# EAGLE design smoke_co_interface (EAGLE 9.6.2)
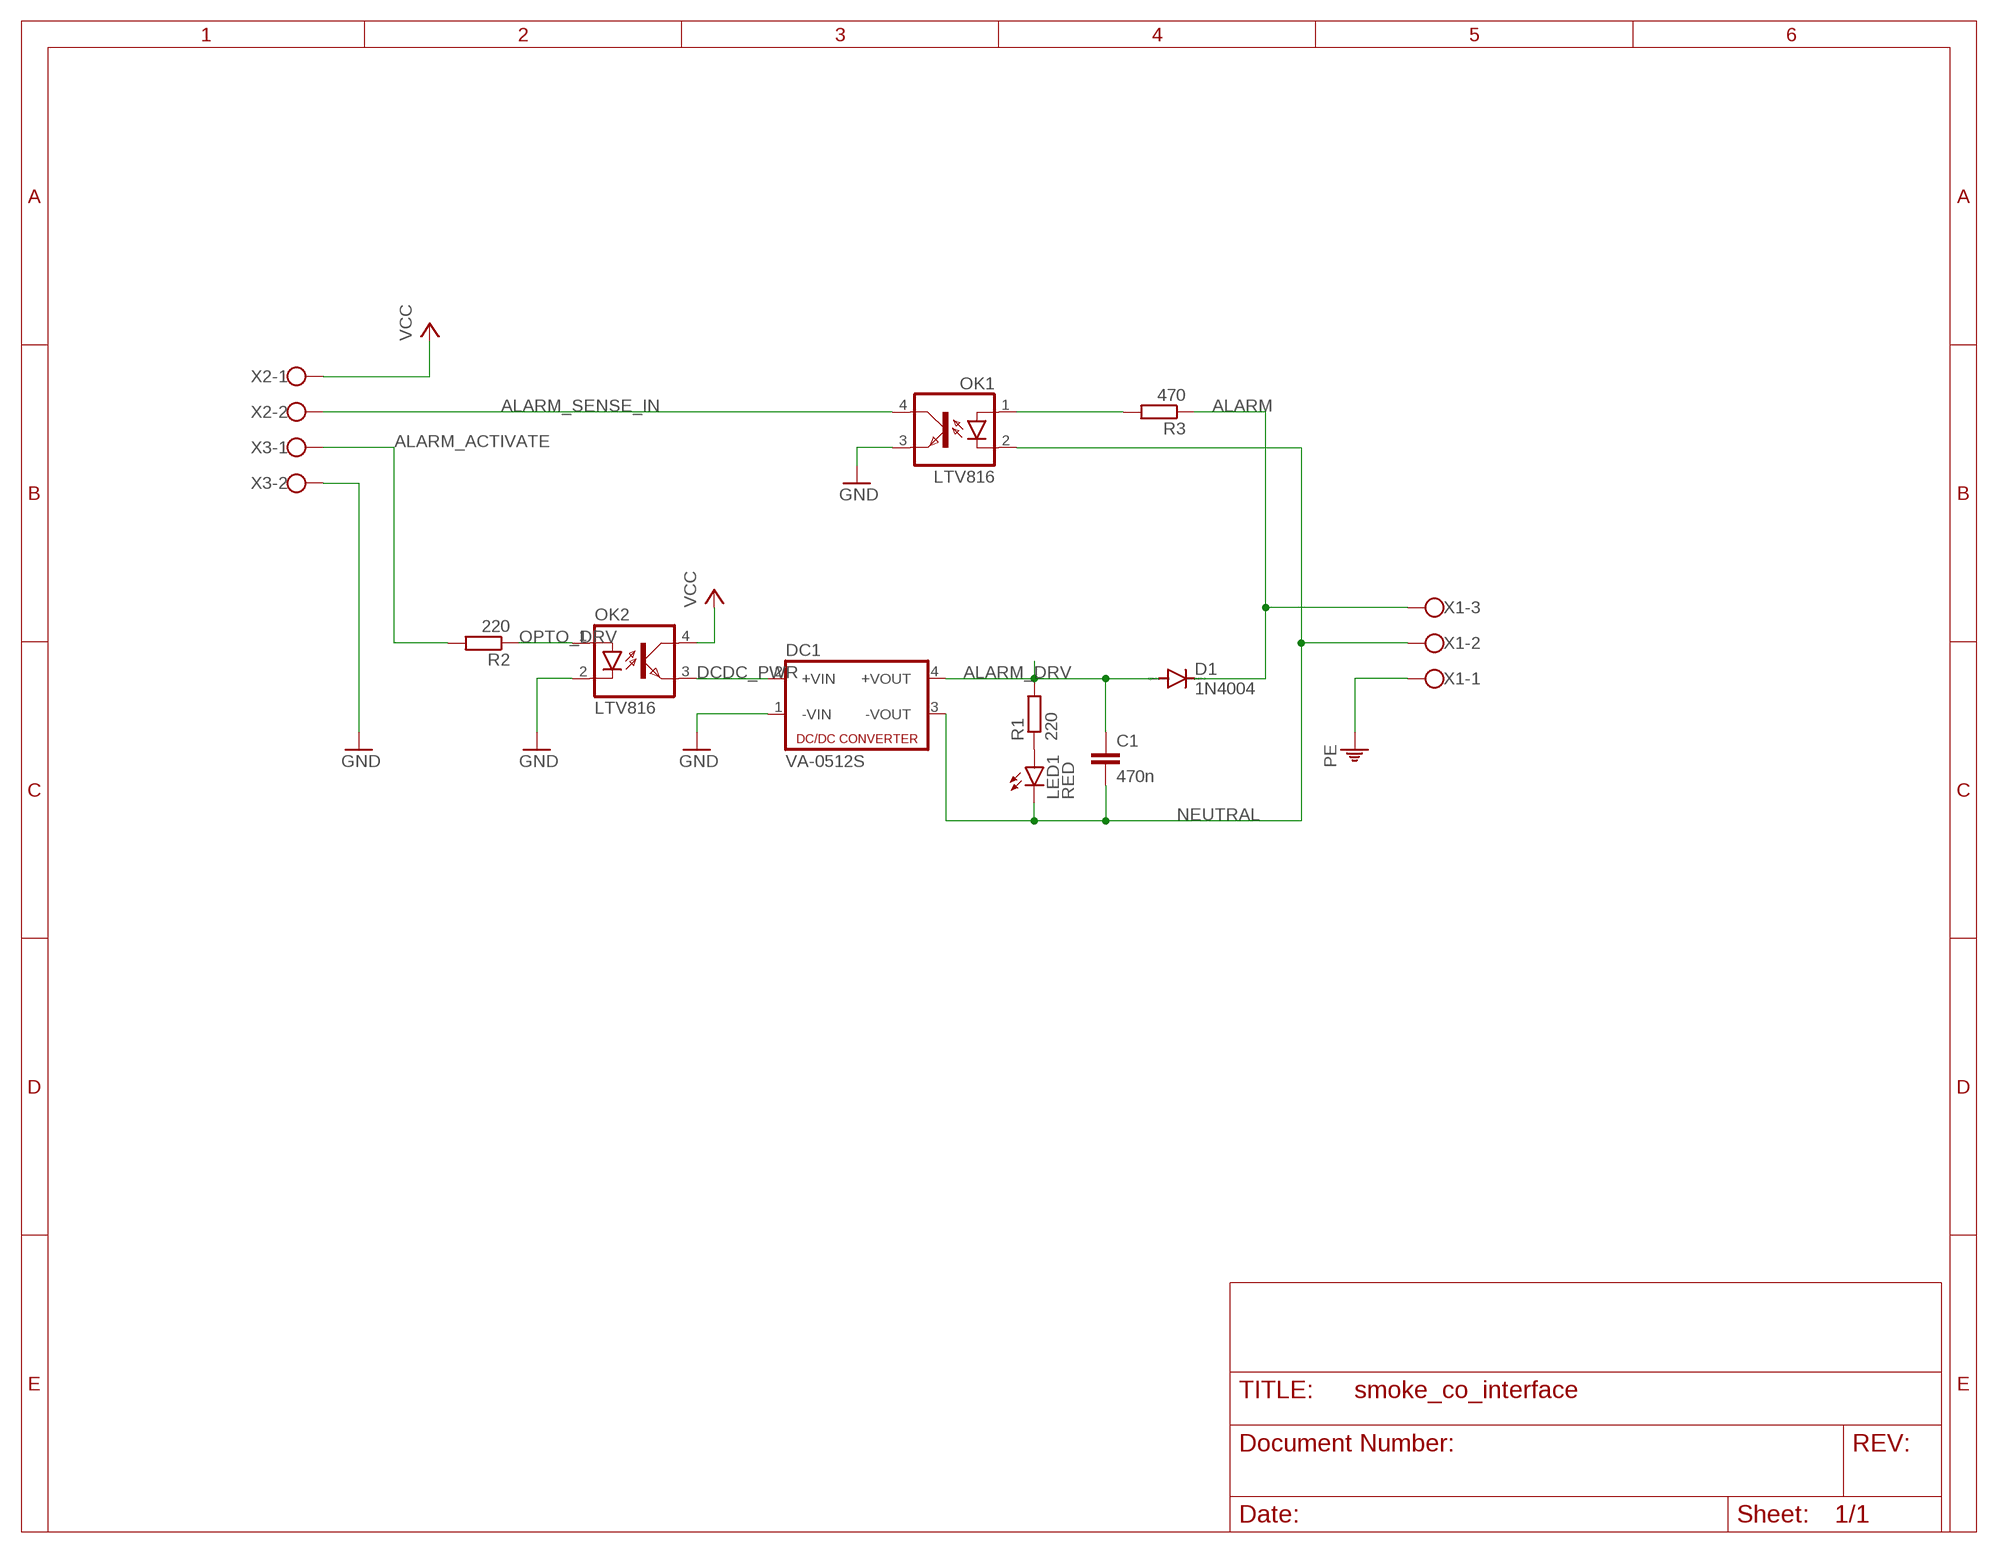
[diagram p0: schematic, sheet 1]

## Parts
C1  470n  C-EU050-035X075  [C050-035X075]
D1  1N4004  [DO41-10]
DC1  VA-0512S  [4SIL]
LED1  RED  LED3MM  [LED3MM]
OK1  LTV816  [DIL04]
OK2  LTV816  [DIL04]
R1  220  R-EU_0207/10  [0207/10]
R2  220  R-EU_0207/10  [0207/10]
R3  470  R-EU_0207/10  [0207/10]
X1  W237-103  [W237-103]
X2  W237-102  [W237-102]
X3  W237-102  [W237-102]

## Nets
ALARM [signal_hv]: D1.C R3.1 X1.3
ALARM_ACTIVATE: R2.2 X3.1
ALARM_DRV [signal_hv]: C1.1 D1.A DC1.4(+VOUT) R1.2
ALARM_SENSE [signal_hv]: OK1.1(A) R3.2
ALARM_SENSE_IN: OK1.4(COL) X2.2
DCDC_PWR: DC1.2(+VIN) OK2.3(EMIT)
GND [supply]: DC1.1(-VIN) OK1.3(EMIT) OK2.2(C) X3.2
N$1 [signal_hv]: LED1.A R1.1
NEUTRAL [supply_hv]: C1.2 DC1.3(-VOUT) LED1.K(C) OK1.2(C) X1.2
OPTO_DRV: OK2.1(A) R2.1
PE [supply_hv]: X1.1
VCC [supply]: OK2.4(COL) X2.1

## Library data of the parts
C1 = rcl:C-EU: CAPACITOR, European symbol; SPICEPREFIX: C
D1 = diode:1N4004: DIODE general purpose rectifier, 1 A
DC1 = dc-dc-converter:VA-*?: DC DC Converter Single Output, 1 Watt Motien Technology Co.,Ltd. Source: Data sheet <http://www.motien.com.tw/data_sheet/VA-1%28H%29.pdf>; OC_FARNELL: unknown; OC_NEWARK: unknown
LED1 = led:LED: LED OSRAM: - CHIPLED LG R971, LG N971, LY N971, LG Q971, LY Q971, LO R971, LY R971 LH N974, LH R974 LS Q976, LO Q976, LY Q976 LO Q996 - Hyper CHIPLED LW Q18S LB Q993, LB Q99A, LB R99A - SideLED LS A670, LO A670, LY A670, LG A670, LP A670 LB A673, LV A673, LT A673, LW A673 LH A674 LY A675 LS A676, LA A676, LO A676, LY A676, LW A676 LS A679, LY A679, LG A679 - Hyper Micro SIDELED® LS Y876, LA Y876, LO Y876, LY Y876 LT Y87S - SmartLED LW L88C, LW L88S LB L89C, LB L89S, LG L890 LS L89K, LO L89K, LY L89K LS L896, LA L896, LO L896, LY L896 - TOPLED LS T670, LO T670, LY T670, LG T670, LP T670 LSG T670, LSP T670, LSY T670, LOP T670, LYG T670 LG T671, LOG T671, LSG T671 LB T673, LV T673, LT T673, LW T673 LH T674 LS T676, LA T676, LO T676, LY T676, LB T676, LH T676, LSB T676, LW T676 LB T67C, LV T67C, LT T67C, LS T67K, LO T67K, LY T67K, LW E67C LS E67B, LA E67B, LO E67B, LY E67B, LB E67C, LV E67C, LT E67C LW T67C LS T679, LY T679, LG T679 LS T770, LO T770, LY T770, LG T770, LP T770 LB T773, LV T773, LT T773, LW T773 LH T774 LS E675, LA E675, LY E675, LS T675 LS T776, LA T776, LO T776, LY T776, LB T776 LHGB T686 LT T68C, LB T68C - Hyper Mini TOPLED® LB M676 - Mini TOPLED Santana® LG M470 LS M47K, LO M47K, LY M47K Source: http://www.osram.convergy.de LUXEON: - LUMILED® LXK2-PW12-R00, LXK2-PW12-S00, LXK2-PW14-U00, LXK2-PW14-V00 LXK2-PM12-R00, LXK2-PM12-S00, LXK2-PM14-U00 LXK2-PE12-Q00, LXK2-PE12-R00, LXK2-PE12-S00, LXK2-PE14-T00, LXK2-PE14-U00 LXK2-PB12-K00, LXK2-PB12-L00, LXK2-PB12-M00, LXK2-PB14-N00, LXK2-PB14-P00, LXK2-PB14-Q00 LXK2-PR12-L00, LXK2-PR12-M00, LXK2-PR14-Q00, LXK2-PR14-R00 LXK2-PD12-Q00, LXK2-PD12-R00, LXK2-PD12-S00 LXK2-PH12-R00, LXK2-PH12-S00 LXK2-PL12-P00, LXK2-PL12-Q00, LXK2-PL12-R00 Source: www.luxeon.com KINGBRIGHT: KA-3528ASYC Source: www.kingbright.com
OK1 OK2 = optocoupler:LTV816: OPTO COUPLER Source: LITEON, LTV816.pdf; OC_FARNELL: unknown; OC_NEWARK: unknown
R1-R3 = rcl:R-EU_: RESISTOR, European symbol; SPICEPREFIX: R
X1 = con-wago-500:W237-103: WAGO SCREW CLAMP; MPN: 237-103; OC_FARNELL: unknown; OC_NEWARK: 18M7116
X2 X3 = con-wago-500:W237-102: WAGO SCREW CLAMP; MPN: 237-102; OC_FARNELL: unknown; OC_NEWARK: 70K9898

## Net classes
0 default: width 0.813 mm
1 supply: width 1.626 mm
2 signal_hv: width 0.813 mm, clearance 0.61 mm
3 supply_hv: width 1.626 mm, clearance 0.61 mm

## Board
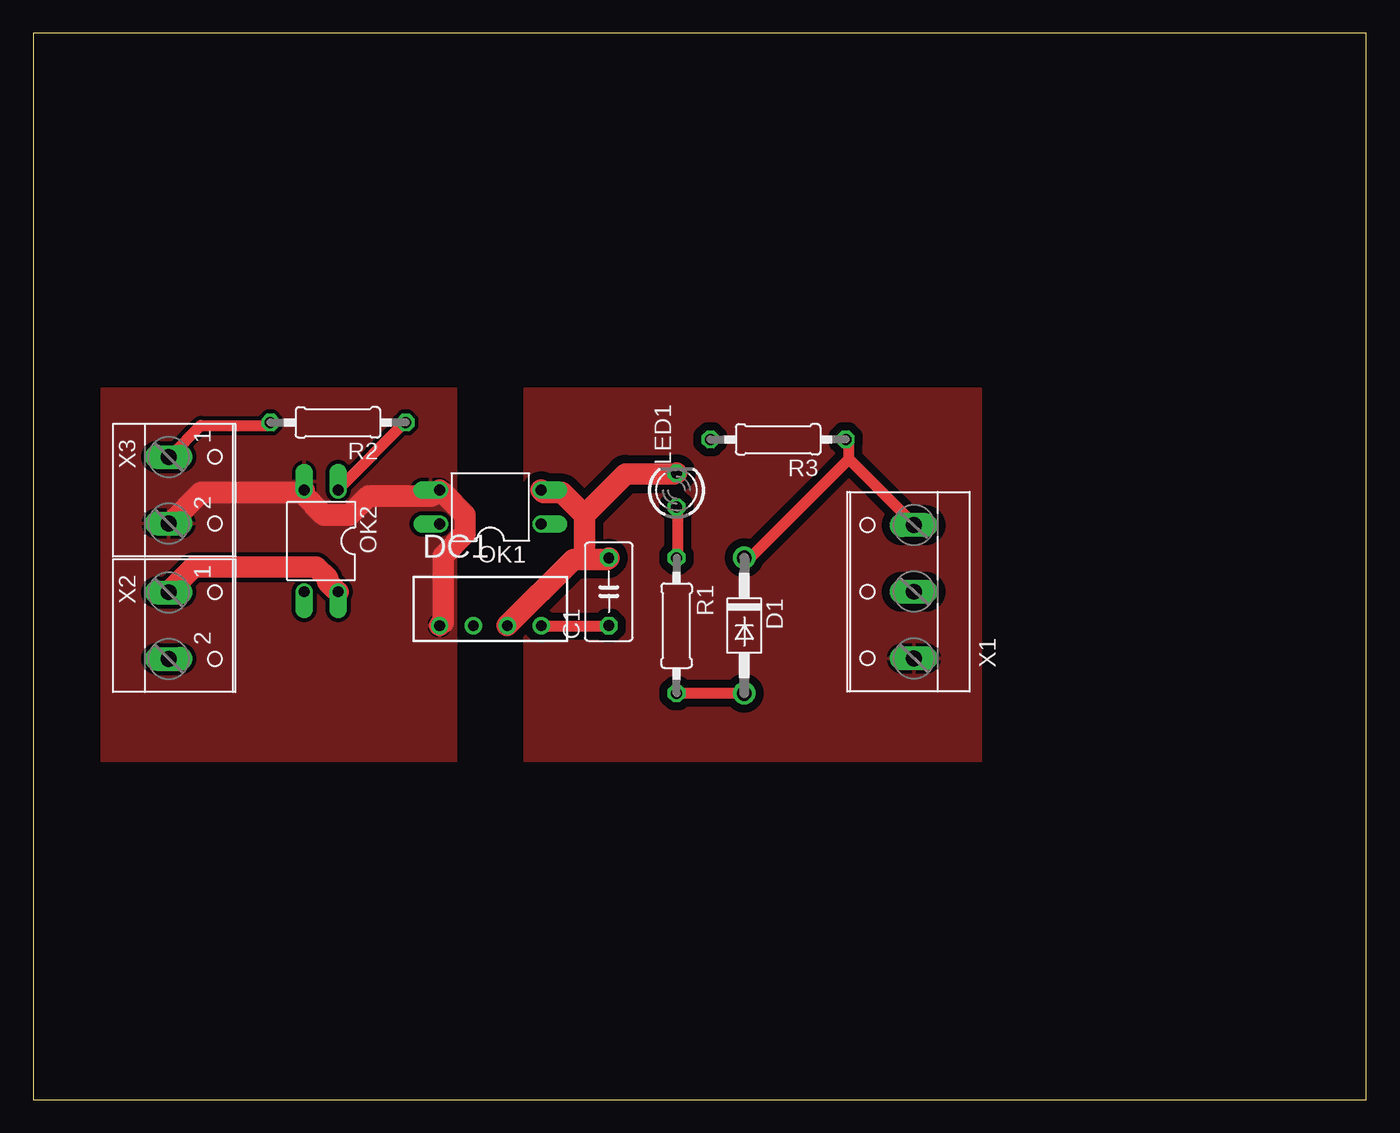
[diagram p1: board, top side]
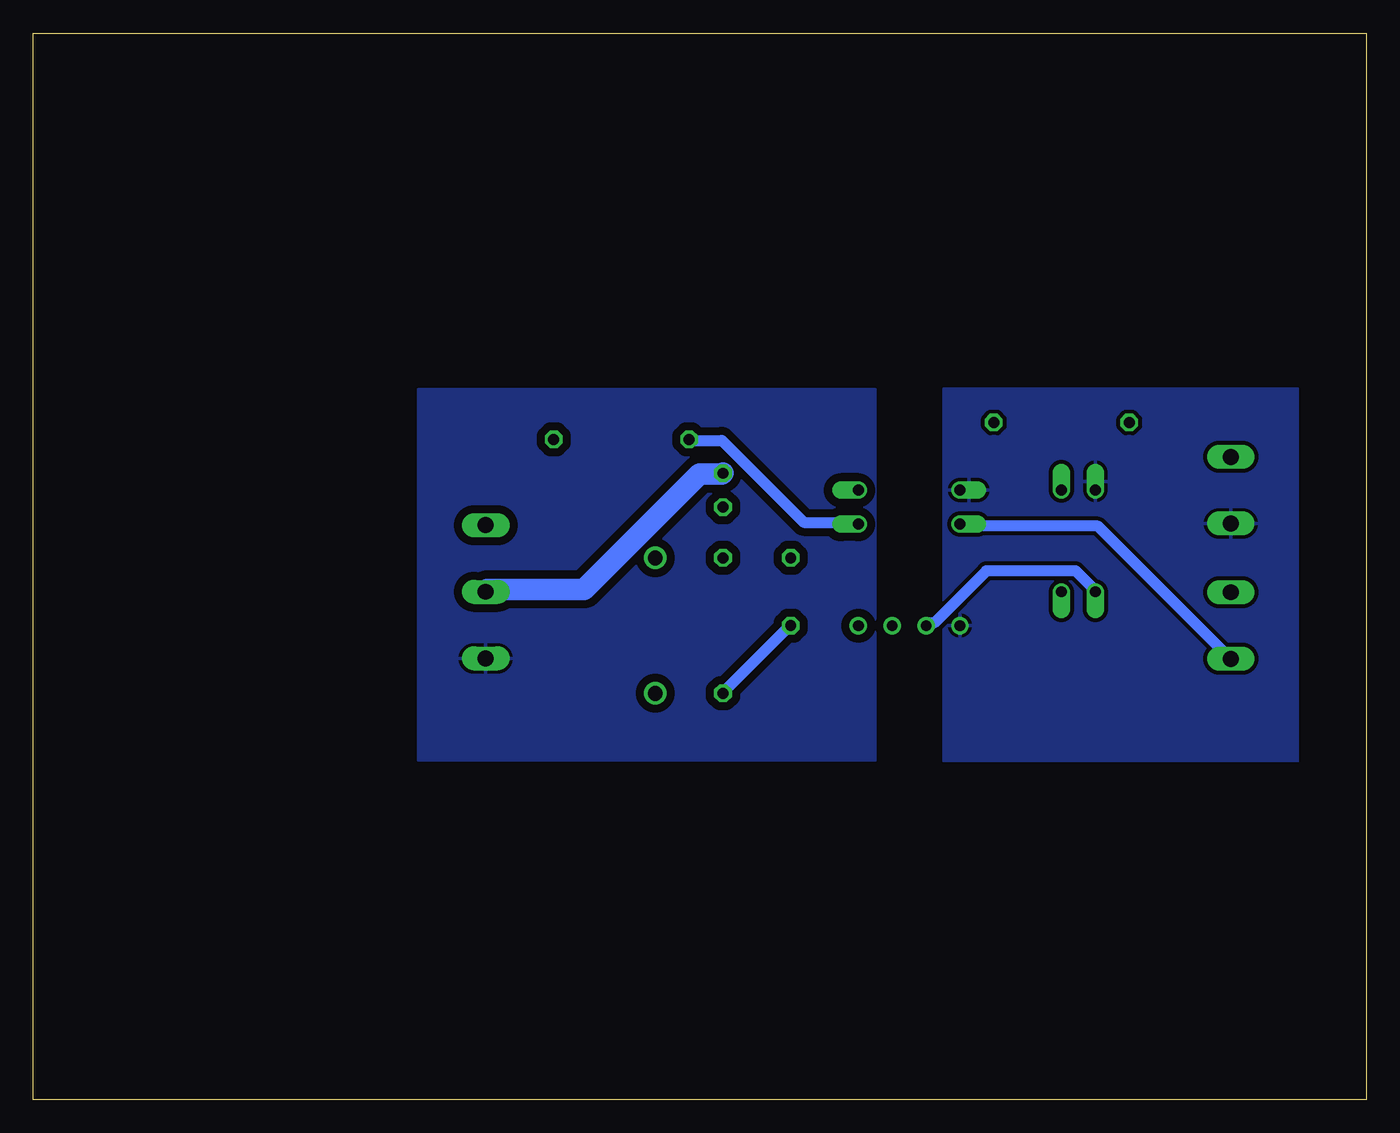
[diagram p2: board, bottom side, seen from below]

Size 100 x 80 mm. Coordinates in mm from the lower left corner, seen from the top.
Outline: 0,0 100,0 100,80 0,80 0,0
Copper layers (1*16): Top 0.035mm / dielectric 1.5mm / Bottom 0.035mm
Design rules "default *": minimum track width 12mil, minimum drill 0.7mm, track to track 12mil, track to pad 12mil, pad to pad 12mil, via to via 12mil, smd to smd 6mil, copper to edge 40mil, drill to drill 12mil, minimum pad ring 10mil, minimum via ring 8mil, stop-mask expansion 4mil, vias tented up to drill 0mil, thermal gap 10mil

### Footprints (pad centres in the part's own frame; a part is rotated, then mirrored left to right if it is on the bottom)
C050-035X075 = drill 0.813 octagon: 1 -2.54,0; 2 2.54,0
DO41-10 = drill 1.118: A 5.08,0; C -5.08,0
4SIL = drill 0.8: 1 -3.81,0; 2 -1.27,0; 3 1.27,0; 4 3.81,0
LED3MM = drill 0.813 octagon: A -1.27,0; K 1.27,0
DIL04 = drill 0.813 offset: 1 -1.27,-3.81; 2 1.27,-3.81; 3 1.27,3.81; 4 -1.27,3.81
0207/10 = drill 0.813 octagon: 1 -5.08,0; 2 5.08,0
W237-103 = drill 1.194 long: 1 -5,-1.29; 2 0,-1.29; 3 5,-1.29
W237-102 = drill 1.194 long: 1 -2.5,-1.27; 2 2.5,-1.27

### Placement (x,y rotation side)
C1  43.18,38.1 90 top
D1  53.34,35.56 270 top
DC1  34.29,35.56 0 top
LED1  48.26,45.72 90 top
OK1  34.29,44.45 90 top
OK2  21.59,41.91 180 top
R1  48.26,35.56 270 top
R2  22.86,50.8 180 top
R3  55.88,49.53 180 top
X1  64.77,38.1 90 top
X2  11.43,35.56 270 top
X3  11.43,45.72 270 top

### Tracks (layer width: path | path; a pad name or v marks a point on that pad's centre or on a via)
ALARM
  Top 0.813: 61.19,48.06 61.19,49.45 R3.1 | 61.19,48.06 65.94,43.31 X1.3 | 61.19,48.06 53.92,40.79 53.37,40.79 D1.C
ALARM_ACTIVATE
  Top 0.813: R2.2 17.6,50.57 12.57,50.57 10.34,48.34 X3.1
ALARM_DRV
  Top 0.813: DC1.4 38.28,35.48 43.03,35.48 C1.1 | R1.2 48.34,30.45 53.09,30.45 D1.A
  Bottom 0.813: C1.1 43.31,35.48 48.06,30.73 R1.2
ALARM_SENSE
  Bottom 0.813: OK1.1 38.28,43.31 42.19,43.31 48.34,49.45 50.57,49.45 R3.2
ALARM_SENSE_IN
  Bottom 0.813: OK1.4 30.45,43.03 20.12,43.03 10.34,33.25 X2.2
DCDC_PWR
  Bottom 0.813: DC1.2 32.97,35.76 32.41,35.76 28.5,39.67 21.79,39.67 20.4,38.28 OK2.3
GND
  Top 1.626: DC1.1 30.73,35.76 30.73,40.79 32.41,42.47 32.41,43.87 30.73,45.54 OK1.3 29.9,45.26 25.15,45.26 23.75,43.87 21.79,43.87 20.12,45.54 | 20.12,45.54 12.57,45.54 10.34,43.31 X3.2 | 20.12,45.54 OK2.2
  pour Bottom: 30.48,53.34 31.75,53.34 31.75,25.4 5.08,25.4 5.08,53.34
  pour Top: 5.08,53.34 5.08,25.4 31.75,25.4 31.75,53.34
N$1
  Top 0.813: R1.1 48.34,40.79 48.34,44.42 LED1.A
NEUTRAL
  Top 1.626: DC1.3 40.51,40.51 41.35,40.51 | 41.35,40.51 43.03,40.51 C1.2 | 41.35,43.87 39.67,45.54 38.28,45.54 OK1.2 | 41.35,40.51 41.35,43.87 | 41.35,43.87 44.42,46.94 48.06,46.94 LED1.K
  Bottom 1.626: X1.2 65.94,38.28 58.67,38.28 50.01,46.94 48.34,46.94 LED1.K
OPTO_DRV
  Top 0.813: OK2.1 22.91,45.82 27.94,50.85 R2.1
PE
  pour Top: 36.83,53.34 36.83,25.4 71.12,25.4 71.12,53.34
  pour Bottom: 36.83,53.34 36.83,25.4 71.12,25.4 71.12,53.34
VCC
  Top 1.626: OK2.4 22.63,38.28 22.07,38.84 22.07,39.12 21.23,39.95 12.01,39.95 10.34,38.28 X2.1